# Altium project STDC14 Breakout.PrjPcb
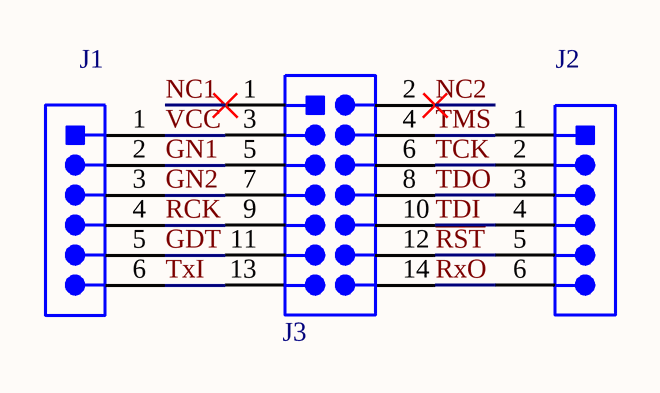
[diagram p0: Top Sheet.SchDoc]

1 sheet, 3 parts. Net scope: global (net labels, ports and power ports of the same name join across sheets).
Board file: STDC14 Breakout.PcbDoc

## Sheet Top Sheet.SchDoc
size Letter; Address4: USA

### Parts
J1  6 contacts Male header  [PH1-06-UA]  (value not drawn)
J2  6 contacts Male header  [PH1-06-UA]  (value not drawn)
J3  STDC14 Debug Connector  [FTSH-107-01-F-DV-K PLUGOUT]  (value not drawn)

### Nets
~{RST}: J2.5 J3.12(~{RESET})
GDT: J1.5 J3.11(GNDDetect)
GN1: J1.2 J3.5(GND)
GN2: J1.3 J3.7(GND)
NC1: J3.1(Reserved)
NC2: J3.2(Reserved)
RCK: J1.4 J3.9(RCLK)
RxO: J2.6 J3.14(RxD)
TCK: J2.2 J3.6(SWDCLK/TCK)
TDI: J2.4 J3.10(NC/TDI)
TDO: J2.3 J3.8(SWO/TDO)
TMS: J2.1 J3.4(SWDIO/TMS)
TxI: J1.6 J3.13(TxD)
VCC: J1.1 J3.3(VCC)

### Notes on the sheet
- Title:
- Desc:
- Size:
- Date:
- File:
- Repo:
- Letter
- Auth:
- Time:
- Sheet
- Proj:
- of

### Library data of the parts
J1 J2 = PH1-06-UA: Connector Male Header 1X6 6contacts 0.100in pitch Gold Flash; Manufacturer: Adam Tech; PCB Package: 1x6 THT; Description in Visual: Con Hdr Male 6contacts vertical 1x6; Number of Contacts: 6; P/N: PH1-06-UA; Manufacturer P/N: PH1-06-UA; Orientation: vertical; Number of Rows: 1; Pitch: 0.100in; Contact Finish: Gold; Gender: Male; ComponentLink1Description: Manufacturer Website; ComponentLink1URL: http://www.adam-tech.com/; ComponentLink2Description: Component Datasheet; ComponentLink2URL: http://www.adam-tech.com/downloader.php?p=PH1-XX-UA.pdf; Supplier 1: Digi-Key; Supplier Part Number 1: 2057-PH1-06-UA-ND; Supplier Part Number 2: 732-5319-ND; Supplier 2: Digi-Key
J3 = STDC14-Debug: STDC14 Debug Connector (ST Micro extension to the Cortex 10 Pin), 0.050" (1.27mm) Pitch; Manufacturer: Samtec; Manufacturer P/N: FTSH-107-01-F-DV-K; Number of Contacts: 14; Gender: Male; P/N: STDC14-Debug; Description in Visual: STDC14 Debug Connector (ST Micro extension to the Cortex 10 Pin), 0.050" (1.27mm) Pitch; Orientation: Vertical; Number of Rows: 2; Pitch: 0.050"; Contact Finish: Gold; ComponentLink1Description: Pinout Reference; ComponentLink1URL: https://www.st.com/resource/en/user_manual/dm00526767-stlinkv3set-debuggerprogrammer-for-stm8-and-stm32-stmicroelectronics.pdf; ComponentLink2Description: Datasheet for Connector; ComponentLink2URL: http://suddendocs.samtec.com/catalog_english/ftsh_smt.pdf; Supplier 3: Digi-Key; Supplier Part Number 3: FTSH-107-01-F-DV-K-P-ND; Supplier 1: Digi-Key; Supplier Part Number 1: SAM13170TR-ND; Supplier 2: Digi-Key; Supplier Part Number 2: 612-FTSH-107-01-F-DV-K-ND